# EAGLE design iot_pcb (EAGLE 9.6.2)

## Sheet 1 of 2
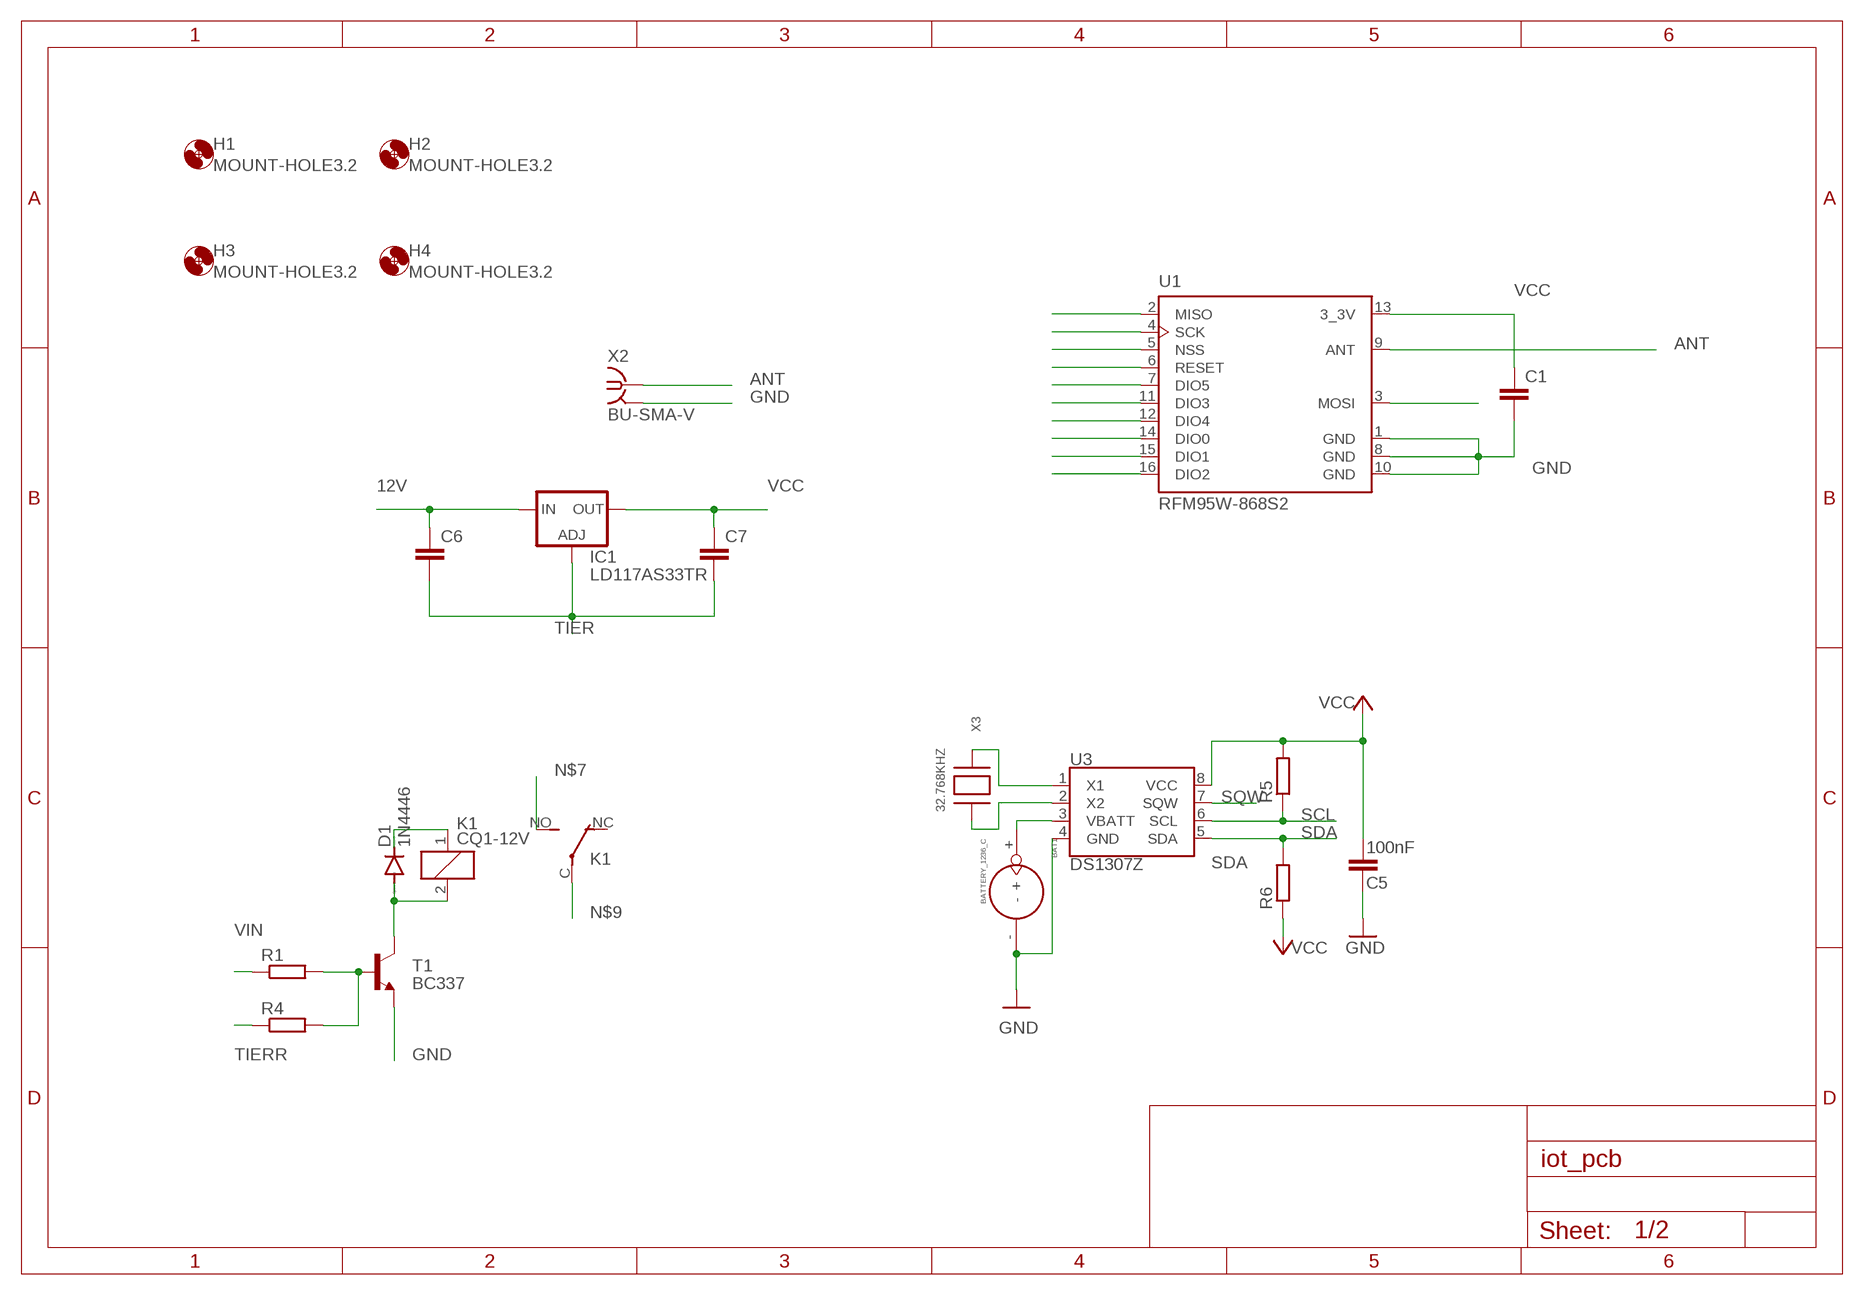
[diagram p0: schematic, sheet 1]

### Parts
BAT1  BATTERY_1236_C  [BATTERY_1236_C]
C1  C-EU050-025X075  [C050-025X075]
C5  100nF  C-EUC0603  [C0603]
C6  C-EU050-025X075  [C050-025X075]
C7  C-EU050-025X075  [C050-025X075]
D1  1N4446  [DO35-10]
H1  MOUNT-HOLE3.2  [3,2]
H2  MOUNT-HOLE3.2  [3,2]
H3  MOUNT-HOLE3.2  [3,2]
H4  MOUNT-HOLE3.2  [3,2]
IC1  LD117AS33TR  [SOT223]
K1  CQ1-12V  [CQ1]
R1  R-EU_0207/10  [0207/10]
R4  R-EU_0207/10  [0207/10]
R5  R-EU_0207/10  [0207/10]
R6  R-EU_0207/10  [0207/10]
T1  BC337  [TO92]
U1  RFM95W-868S2  [XCVR_RFM95W-868S2]
U3  DS1307Z  [SO08-0.15]
X2  BU-SMA-V  [BU-SMA-V]
X3  32.768KHZ  XTAL-3.2X1.5  [XTAL3215]

### Nets
12V: C6.1 IC1.3(IN)
ANT: U1.9(ANT) X2.1
GND: BAT1.- C1.2 C5.1 T1.1(E) U1.1(GND) U1.8(GND) U1.10(GND) U3.4(GND) X2.2 X2.3 X2.4 X2.5 ; also sheet 2
N$2: BAT1.+ U3.3(VBATT)
N$3: U3.1(X1) X3.P$2
N$7: K1.NO(2:S) ; also sheet 2
N$9: K1.C(2:P) ; also sheet 2
N$21: U1.6(RESET)
N$22: U1.5(NSS)
N$37: U3.2(X2) X3.P$1
N$38: D1.A K1.2 T1.3(C)
N$39: D1.C K1.1
N$40: R1.2 R4.2 T1.2(B)
N$45: U1.2(MISO)
N$46: U1.4(SCK)
N$49: U1.7(DIO5)
N$50: U1.11(DIO3)
N$51: U1.12(DIO4)
N$52: U1.14(DIO0)
N$53: U1.15(DIO1)
N$54: U1.16(DIO2)
N$58: U1.3(MOSI)
SCL: R5.1 U3.6(SCL)
SDA: R6.2 U3.5(SDA)
SQW: U3.7(SQW)
TIER: C6.2 C7.2 IC1.1(ADJ)
TIERR: R4.1
VCC: C1.1 C5.2 C7.1 IC1.4(OUT) R5.2 R6.1 U1.13(3_3V) U3.8(VCC)
VIN: R1.1
Unconnected: K1.NC(2:O)

## Sheet 2 of 2
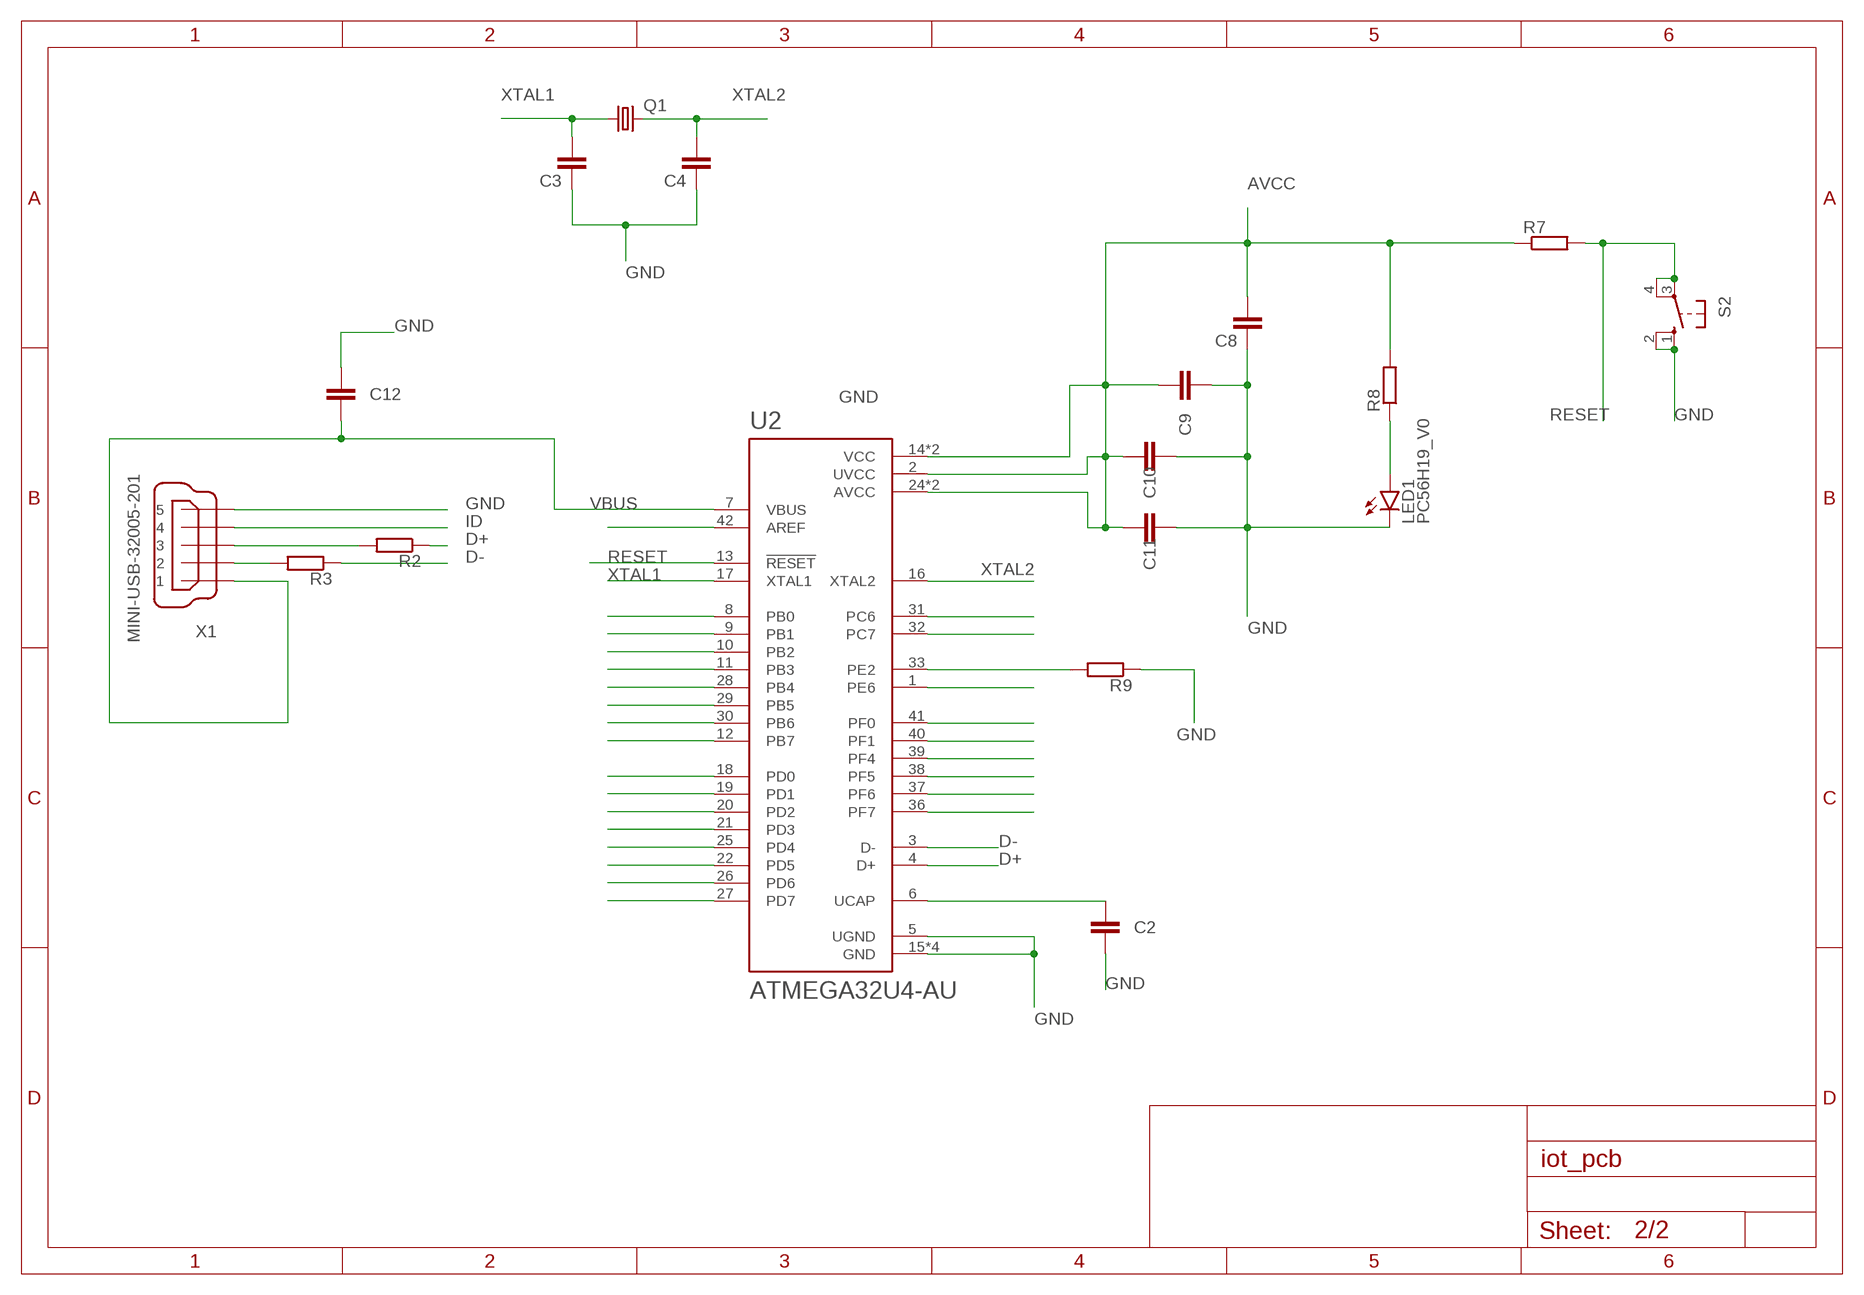
[diagram p1: schematic, sheet 2]

### Parts
C2  C-EU050-025X075  [C050-025X075]
C3  C-EU050-025X075  [C050-025X075]
C4  C-EU050-025X075  [C050-025X075]
C8  C-EU050-025X075  [C050-025X075]
C9  C-EU050-025X075  [C050-025X075]
C10  C-EU050-025X075  [C050-025X075]
C11  C-EU050-025X075  [C050-025X075]
C12  C-EU050-025X075  [C050-025X075]
LED1  PC56H19_V0  [PC56H19_V0]
Q1  CRYSTALHC49S  [HC49/S]
R2  R-EU_0204/7  [0204/7]
R3  R-EU_0204/7  [0204/7]
R7  R-EU_0204/7  [0204/7]
R8  R-EU_0204/7  [0204/7]
R9  R-EU_0204/7  [0204/7]
S2  40-XX  [B3F-40XX]
U2  ATMEGA32U4-AU  [QFP80P1200X1200X120-44N]
X1  MINI-USB-32005-201  [32005-201]

### Nets
AVCC: C8.2 C9.2 C10.2 C11.1 R7.1 R8.2 U2.2(UVCC) U2.14(VCC) U2.24(AVCC) U2.34(VCC) U2.44(AVCC)
D+: R2.1 U2.4(D+)
D-: R3.1 U2.3(D-)
GND: C2.2 C3.1 C4.1 C8.1 C9.1 C10.1 C11.2 C12.1 LED1.1(C) LED1.3(C) R9.1 S2.1(S) S2.2(S1) U2.5(UGND) U2.15(GND) U2.23(GND) U2.35(GND) U2.43(GND) X1.5 ; also sheet 1
ID: X1.4
N$1: C2.1 U2.6(UCAP)
N$4: U2.42(AREF)
N$5: U2.8(PB0)
N$6: U2.9(PB1)
N$7: U2.10(PB2) ; also sheet 1
N$8: U2.11(PB3)
N$9: U2.28(PB4) ; also sheet 1
N$10: U2.29(PB5)
N$11: U2.30(PB6)
N$12: U2.12(PB7)
N$13: U2.18(PD0)
N$14: U2.19(PD1)
N$15: U2.20(PD2)
N$16: U2.21(PD3)
N$17: U2.25(PD4)
N$18: U2.22(PD5)
N$19: U2.26(PD6)
N$20: U2.27(PD7)
N$23: R3.2 X1.2
N$24: R2.2 X1.3
N$26: U2.36(PF7)
N$27: U2.37(PF6)
N$28: U2.38(PF5)
N$29: U2.39(PF4)
N$30: U2.40(PF1)
N$31: U2.41(PF0)
N$32: U2.1(PE6)
N$33: R9.2 U2.33(PE2)
N$34: U2.32(PC7)
N$35: U2.31(PC6)
N$41: LED1.2(A) LED1.4(A) R8.1
RESET: R7.2 S2.3(P) S2.4(P1) U2.13(!RESET)
VBUS: C12.2 U2.7(VBUS) X1.1
XTAL1: C3.2 Q1.1 U2.17(XTAL1)
XTAL2: C4.2 Q1.2 U2.16(XTAL2)

## Library data of the parts
BAT1 = Itead_BP_110825.lbr:BATTERY_1236_C: SOC004
C1-C12 = rcl:C-EU: CAPACITOR, European symbol; SPICEPREFIX: C
D1 = diode:1N4446: DIODE high speed (Philips)
H1-H4 = holes:MOUNT-HOLE: MOUNTING HOLE with drill center marker
IC1 = v-reg:LD117A?*: Low drop fixed and adjustable positive voltage regulators 1 A Source: http://www.st.com/stonline/products/literature/ds/7194/ld1117axx.pdf
K1 = relay:CQ1-12V: AUTOMOTIVE QUIET RELAY NAiS Source: http://www.mew-europe.com/.. en_ds_61208_0000.pdf; OC_FARNELL: unknown; OC_NEWARK: unknown
LED1 = led:PC56H19_V0: Lextar white SMD LED Source: PC56H19_20150317.pdf www.lextar.com
Q1 = crystal:CRYSTAL: CRYSTAL; OC_FARNELL: 1667008; OC_NEWARK: unknown
R1-R9 = rcl:R-EU_: RESISTOR, European symbol; SPICEPREFIX: R
S2 = switch-omron:40-XX: OMRON SWITCH; MF: OMRON COMPONENTS USA; MPN: B3F-4000; OC_FARNELL: 176434; OC_NEWARK: 36K3105
T1 = transistor:BC337: NPN TRANSISTOR
U1 = RFM95W-868S2:RFM95W-868S2: Mod Txrx Lora +20dbm 868mhz Smd Check availability <https://pricing.snapeda.com/parts/RFM95W-868S2/RF/view-part?ref=eda>; AVAILABILITY: In Stock; DESCRIPTION: General ISM < 1GHz LoRa™ Transceiver Module 868MHz Antenna Not Included Surface Mount; MF: RF; MP: RFM95W-868S2; PACKAGE: SMD-16 Hope Microelectronics; PRICE: None; PURCHASE-URL: https://pricing.snapeda.com/search/part/RFM95W-868S2/?ref=eda
U2 = ATMEGA32U4-AU:ATMEGA32U4-AU: ATmega Series 16 MHz 32 KB Flash 2.5 KB SRAM 8-Bit Microcontroller - TQFP-44 Check availability <https://pricing.snapeda.com/parts/ATMEGA32U4-AU/Rochester%20Electronics%2C%20LLC/view-part?ref=eda>; AVAILABILITY: In Stock; DESCRIPTION: AVR AVR® ATmega Microcontroller IC 8-Bit 16MHz 32KB (16K x 16) FLASH 44-TQFP (10x10); MF: Rochester Electronics, LLC; MP: ATMEGA32U4-AU; PACKAGE: None; PRICE: None; PURCHASE-URL: https://pricing.snapeda.com/search/part/ATMEGA32U4-AU/?ref=eda
U3 = SparkFun-Clocks:DS1307: Maxim DS1307 - I2C Real-time clock (RTC) The DS1307 serial real-time clock (RTC) is a low-power, full binary-coded decimal (BCD) clock/calendar plus 56 bytes of NV SRAM. Address and data are transferred serially through an I2C, bidirectional bus. The clock/calendar provides seconds, minutes, hours, day, date, month, and year information. SparkFun Products: Real Time Clock Module <https://www.sparkfun.com/products/12708> (BOB-12708) Datasheet <https://cdn.sparkfun.com/datasheets/BreakoutBoards/DS1307.pdf>; PROD_ID: IC-08138
X1 = con-cypressindustries:MINI-USB-: MINI USB-B Conector Source: www.cypressindustries.com; OC_FARNELL: unknown; OC_NEWARK: unknown
X2 = con-coax:BU-SMA-V: FEMALE SMA CONNECTOR Radiall distributor RS 112-3794; OC_FARNELL: unknown; OC_NEWARK: unknown
X3 = adafruit:XTAL: Low cost SMT crystals, no capacitors included http://www.ladyada.net/library/eagle

## Board
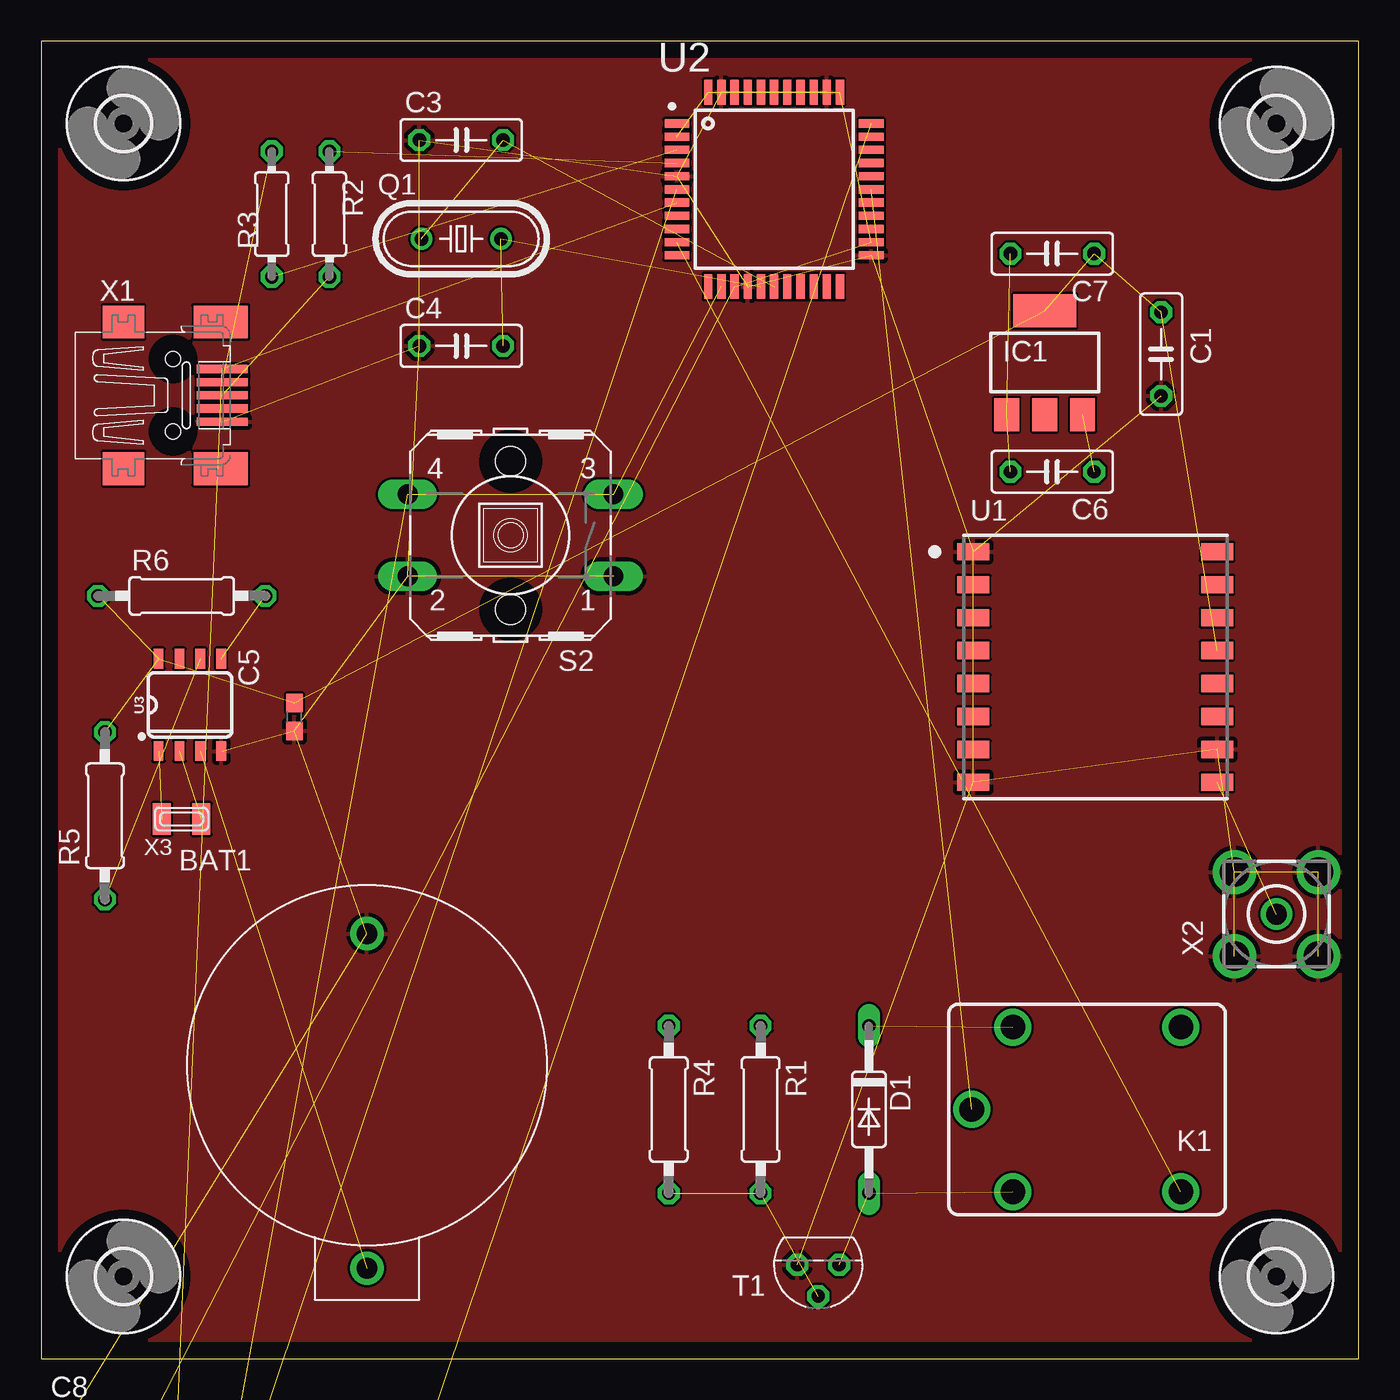
[diagram p2: board, top side]
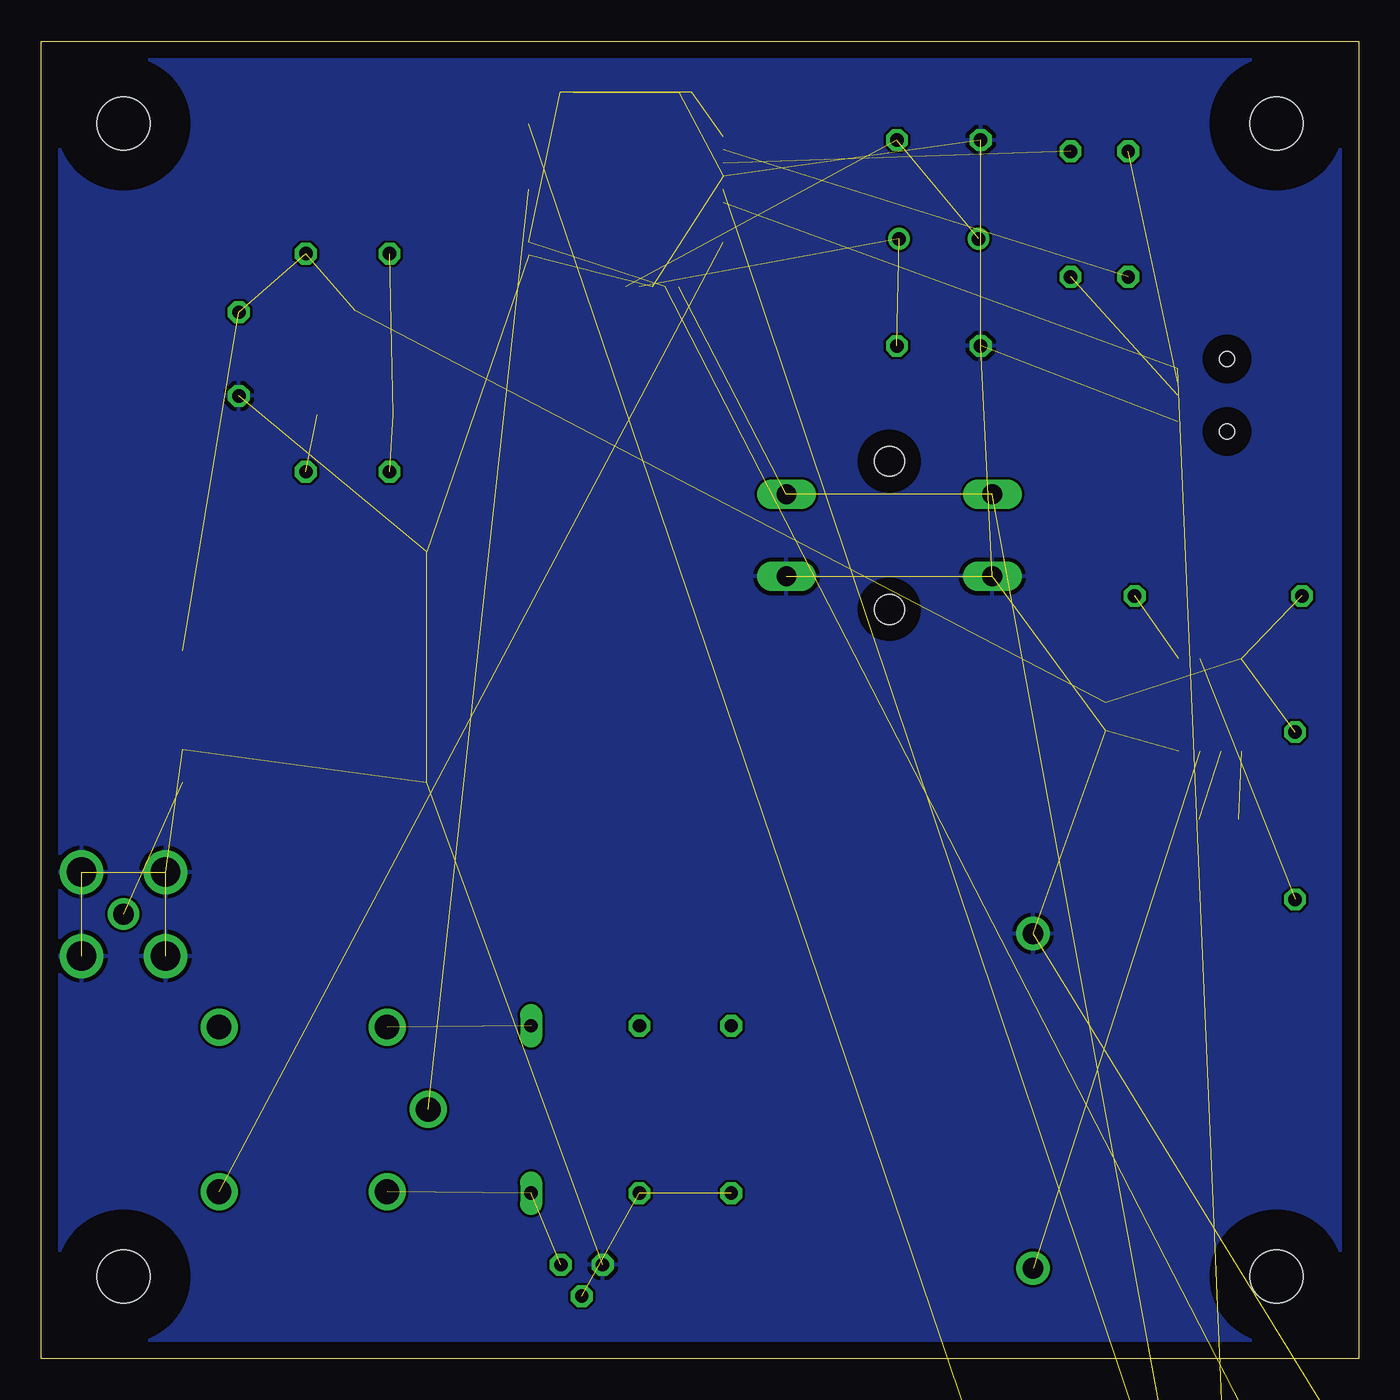
[diagram p3: board, bottom side, seen from below]

Size 80 x 80 mm. Coordinates in mm from the lower left corner, seen from the top.
Outline: 0,0 80,0 80,80 0,80 0,0
Copper layers (1*16): Top 0.035mm / dielectric 1.5mm / Bottom 0.035mm
Design rules "default": minimum track width 6mil, minimum drill 0.35mm, track to track 6mil, track to pad 6mil, pad to pad 6mil, via to via 6mil, smd to smd 6mil, copper to edge 40mil, drill to drill 6mil, minimum pad ring 10mil, minimum via ring 8mil, stop-mask expansion 4mil, vias tented up to drill 0mil, thermal gap 10mil

### Footprints (pad centres in the part's own frame; a part is rotated, then mirrored left to right if it is on the bottom)
BATTERY_1236_C = drill 1.27 pad 2.032: + 0,0; - 0,20.32
C050-025X075 = drill 0.813 octagon: 1 -2.54,0; 2 2.54,0
C0603 = smd 1.1 x 1: 1 -0.85,0; 2 0.85,0
DO35-10 = drill 0.813 long: A 5.08,0; C -5.08,0
3,2 = hole 3.2: 0,0
SOT223 = smd 1.5 x 2: 1 -2.3,-3.15; 2 0,-3.15; 3 2.3,-3.15 | smd 3.8 x 2: 4 0,3.15
CQ1 = drill 1.5: 1 4.5,-5; 2 4.5,5; C 7,0; NC -5.7,-5; NO -5.7,5
PC56H19_V0 = smd 1.63 x 0.9: 1 -2.01,0.65; 3 -2.01,-0.645 | smd 1.73 x 0.9: 2 2.195,0.65; 4 2.195,-0.65
HC49/S = drill 0.813: 1 -2.413,0; 2 2.413,0
0207/10 = drill 0.813 octagon: 1 -5.08,0; 2 5.08,0
0204/7 = drill 0.813 octagon: 1 -3.81,0; 2 3.81,0
B3F-40XX = drill 1.194 long: 1 -6.248,2.489; 2 6.248,2.489; 3 -6.248,-2.489; 4 6.248,-2.489 | hole 1.803: 0,-4.496; 0,4.496
TO92 = drill 0.813 octagon: 1 1.27,0; 2 0,1.905; 3 -1.27,0
XCVR_RFM95W-868S2 = smd 1.95 x 1.05: 1 -7.4,7; 2 -7.4,5; 3 -7.4,3; 4 -7.4,1; 5 -7.4,-1; 6 -7.4,-3; 7 -7.4,-5; 8 -7.4,-7; 9 7.4,-7; 10 7.4,-5; 11 7.4,-3; 12 7.4,-1; 13 7.4,1; 14 7.4,3; 15 7.4,5; 16 7.4,7
QFP80P1200X1200X120-44N = smd 1.5 x 0.5: 1 -5.9,4; 2 -5.9,3.2; 3 -5.9,2.4; 4 -5.9,1.6; 5 -5.9,0.8; 6 -5.9,0; 7 -5.9,-0.8; 8 -5.9,-1.6; 9 -5.9,-2.4; 10 -5.9,-3.2; 11 -5.9,-4; 23 5.9,-4; 24 5.9,-3.2; 25 5.9,-2.4; 26 5.9,-1.6; 27 5.9,-0.8; 28 5.9,0; 29 5.9,0.8; 30 5.9,1.6; 31 5.9,2.4; 32 5.9,3.2; 33 5.9,4 | smd 0.5 x 1.5: 12 -4,-5.9; 13 -3.2,-5.9; 14 -2.4,-5.9; 15 -1.6,-5.9; 16 -0.8,-5.9; 17 0,-5.9; 18 0.8,-5.9; 19 1.6,-5.9; 20 2.4,-5.9; 21 3.2,-5.9; 22 4,-5.9; 34 4,5.9; 35 3.2,5.9; 36 2.4,5.9; 37 1.6,5.9; 38 0.8,5.9; 39 0,5.9; 40 -0.8,5.9; 41 -1.6,5.9; 42 -2.4,5.9; 43 -3.2,5.9; 44 -4,5.9
SO08-0.15 = smd 0.6 x 1.2: 1 -1.905,-2.8; 2 -0.635,-2.8; 3 0.635,-2.8; 4 1.905,-2.8; 5 1.905,2.8; 6 0.635,2.8; 7 -0.635,2.8; 8 -1.905,2.8
32005-201 = smd 3.1 x 0.5: 1 3,1.6; 2 3,0.8; 3 3,0; 4 3,-0.8; 5 3,-1.6 | smd 2.5 x 2: M1 -3,-4.45; M2 -3,4.45 | smd 3.3 x 2: M3 2.9,4.45; M4 2.9,-4.45 | hole 0.9: 0,2.2; 0,-2.2
BU-SMA-V = drill 1.27: 1 0,0 | drill 1.778: 2 -2.55,2.55; 3 2.55,2.55; 4 2.55,-2.55; 5 -2.55,-2.55
XTAL3215 = smd 1.1 x 1.9: P$1 1.2,0; P$2 -1.2,0

### Placement (x,y rotation side)
BAT1  19.78,5.5 0 top
C1  68,61 270 top
C2  4,-39.5 0 top  (outside the outline)
C3  25.5,74 0 top
C4  25.5,61.5 0 top
C5  15.38,38.97 90 top
C6  61.39,53.86 180 top
C7  61.39,67.1 180 top
C8  4,-4 0 top  (outside the outline)
C9  4,-9 0 top  (outside the outline)
C10  4,-14 0 top  (outside the outline)
C11  4,-19 0 top  (outside the outline)
C12  4,-44.5 0 top  (outside the outline)
D1  50.26,15.14 270 top
H1  5,5 0 top
H2  5,75 0 top
H3  75,5 0 top
H4  75,75 0 top
IC1  60.93,60.48 0 top
K1  63.5,15.14 180 top
LED1  3.5,-32.5 0 top  (outside the outline)
Q1  25.5,68 0 top
R1  43.68,15.14 270 top
R2  17.5,69.5 270 top
R3  14,69.5 90 top
R4  38.1,15.14 270 top
R5  3.87,32.97 90 top
R6  8.53,46.32 0 top
R7  4.5,-23.5 0 top  (outside the outline)
R8  4.5,-27.5 0 top  (outside the outline)
R9  4.5,-49 0 top  (outside the outline)
S2  28.5,50 180 top
T1  47.18,5.71 180 top
U1  64,42 0 top
U2  44.5,71 0 top
U3  9.03,39.7 0 top
X1  8,58.5 0 top
X2  75,27 90 top
X3  8.53,32.77 0 top

### Tracks (layer width: path | path; a pad name or v marks a point on that pad's centre or on a via)
12V  (1 unrouted)
ANT  (1 unrouted)
AVCC  (10 unrouted)
D+  (1 unrouted)
D-  (1 unrouted)
GND  (30 unrouted)
  pour Top: 0,80 0,0 80,0 80,80
  pour Bottom: 0,80 0,0 80,0 80,80
N$1  (1 unrouted)
N$2  (1 unrouted)
N$3  (1 unrouted)
N$7  (1 unrouted)
N$9  (1 unrouted)
N$23  (1 unrouted)
N$24  (1 unrouted)
N$33  (1 unrouted)
N$37  (1 unrouted)
N$38  (2 unrouted)
N$39  (1 unrouted)
N$40  (2 unrouted)
N$41  (2 unrouted)
RESET  (3 unrouted)
SCL  (1 unrouted)
SDA  (1 unrouted)
TIER  (2 unrouted)
VBUS  (2 unrouted)
VCC  (7 unrouted)
XTAL1  (2 unrouted)
XTAL2  (2 unrouted)